# EasyEDA Pro project ProPrj_火车手动控制开关_2025-05-28.epro, schematic Schematic1

## Sheets
1 P1: Board Name: Board1; Create Date: 2025-05-04; Page Name: P1; Project Name: 火车手动控制开关_v100; Schematic Name: Schematic1; Update Date: 2025-05-04; Company: 嘉立创EDA; Page Size: A4; Version: V1.0
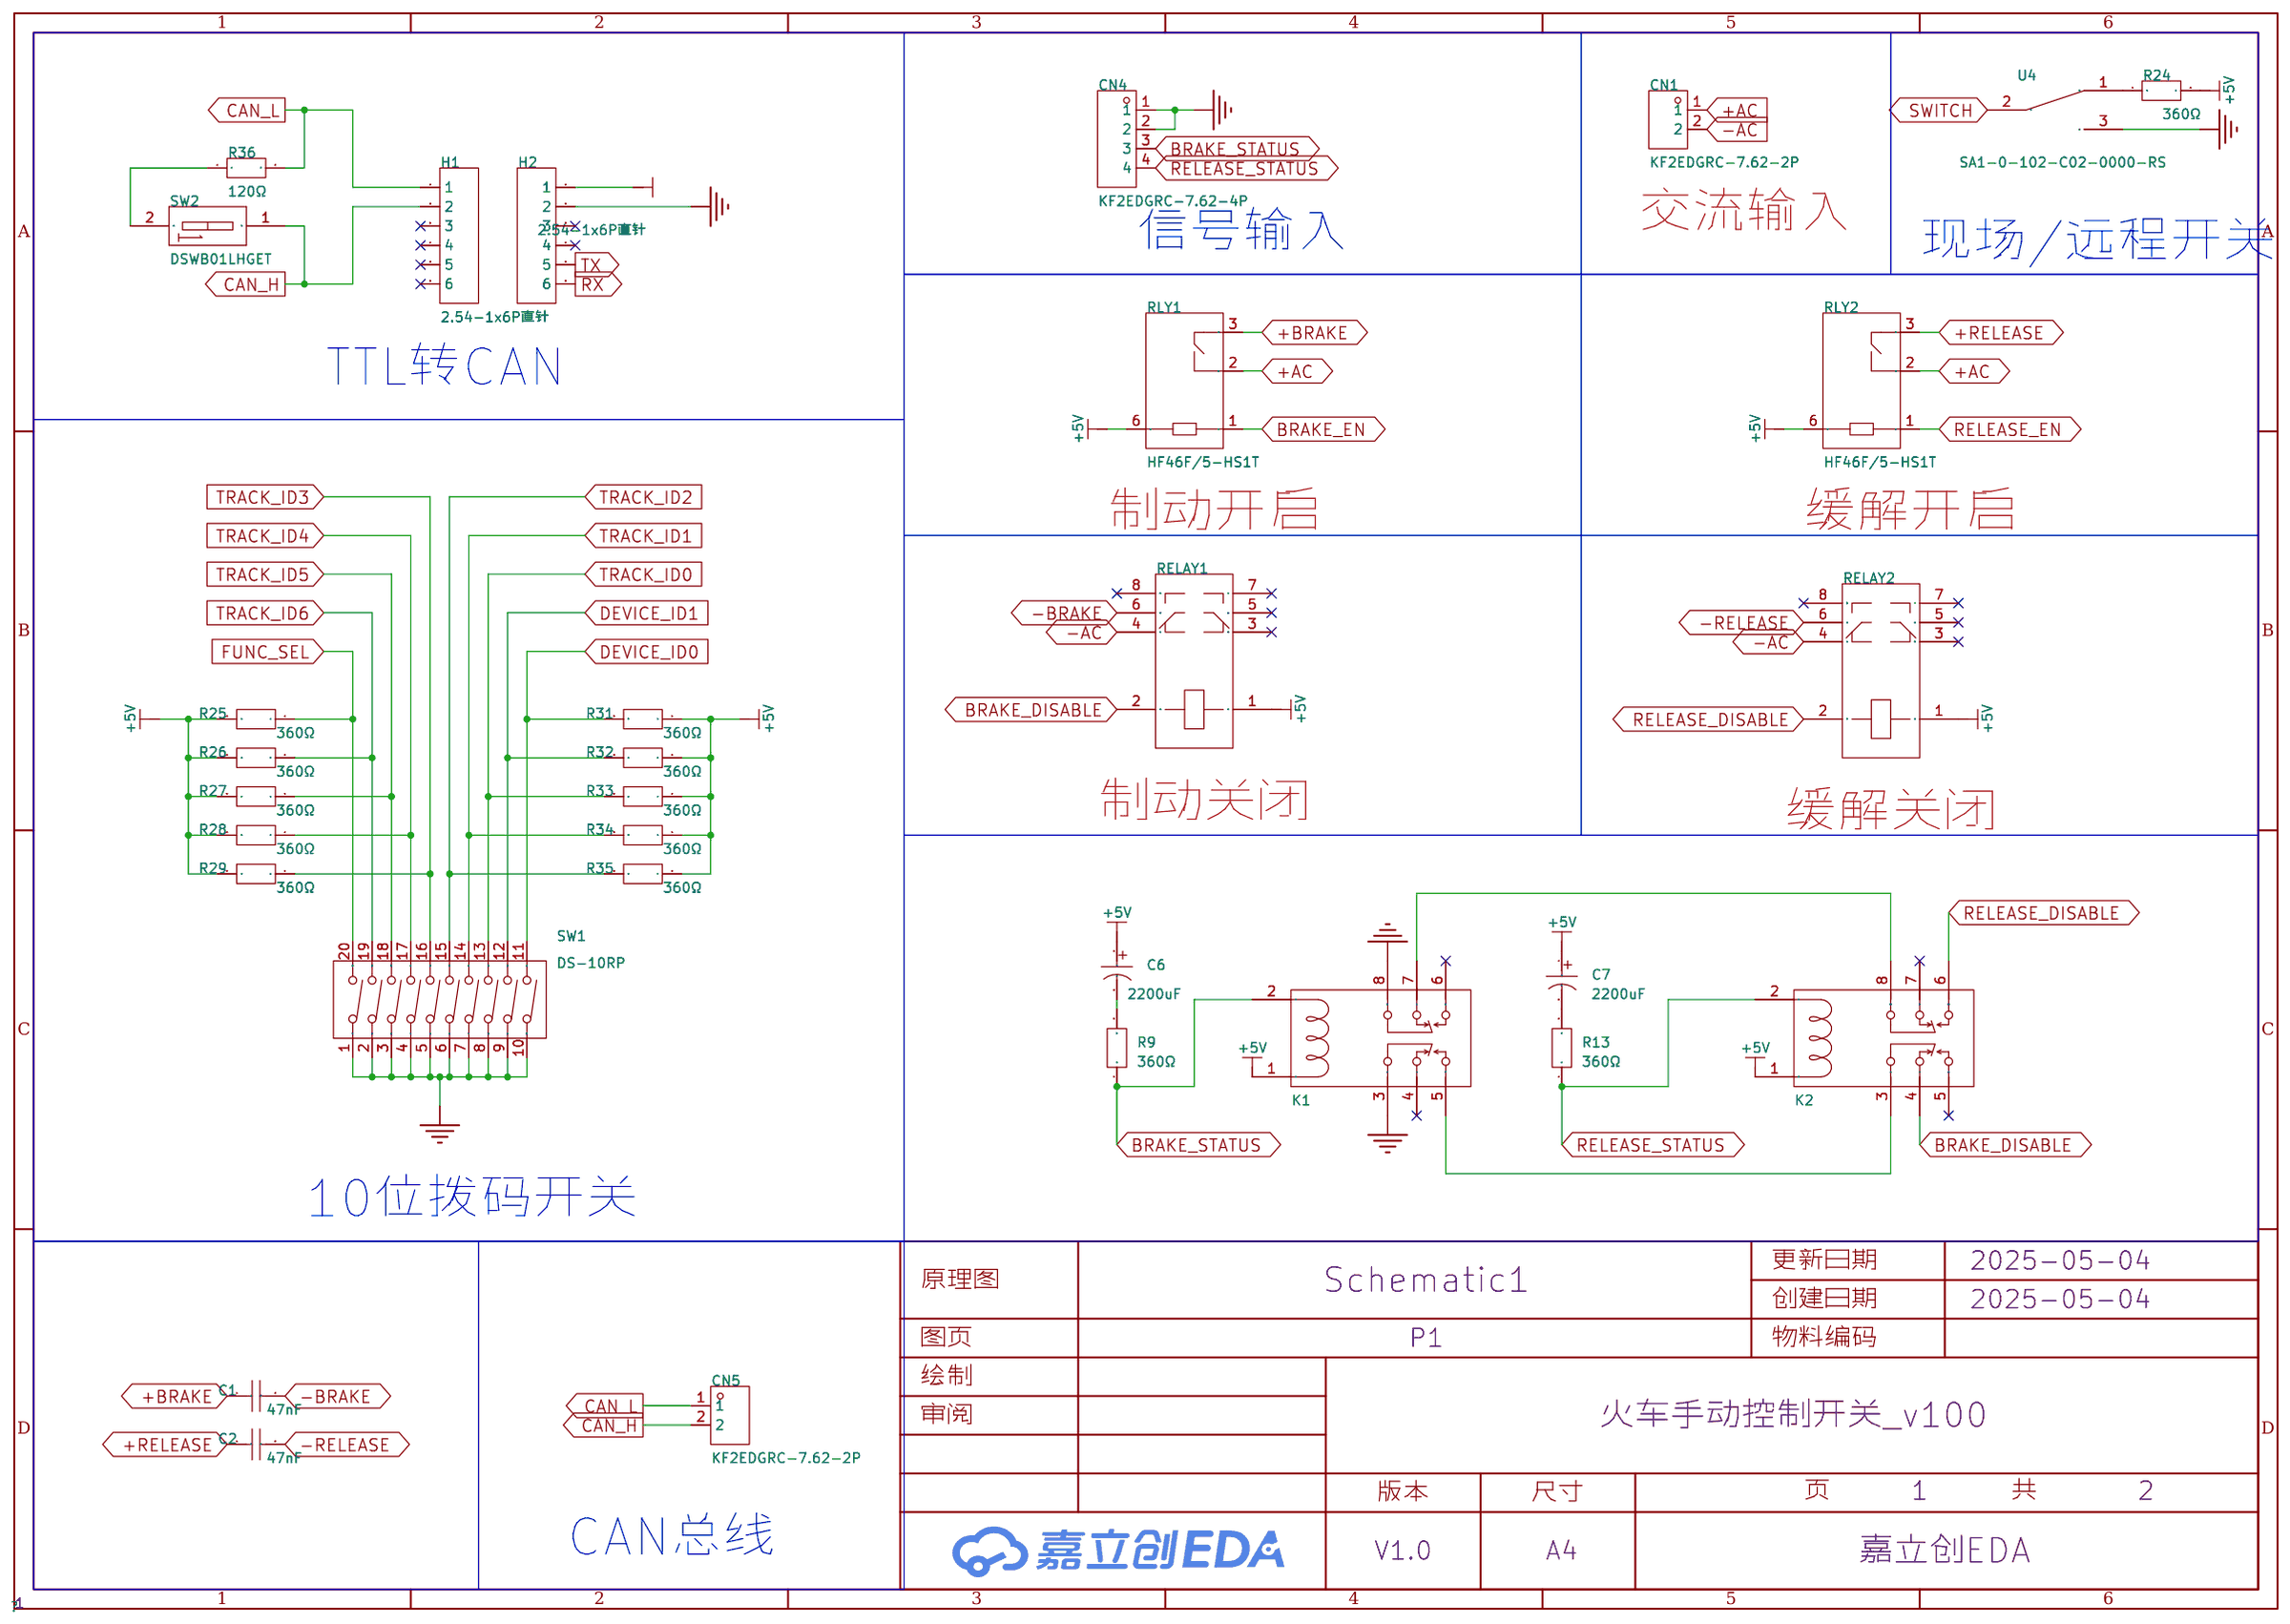
[diagram p0: P1]
2 P2: Create Date: 2025-04-07; Page Name: P2; Project Name: 火车制动系统; Update Date: 2025-04-19
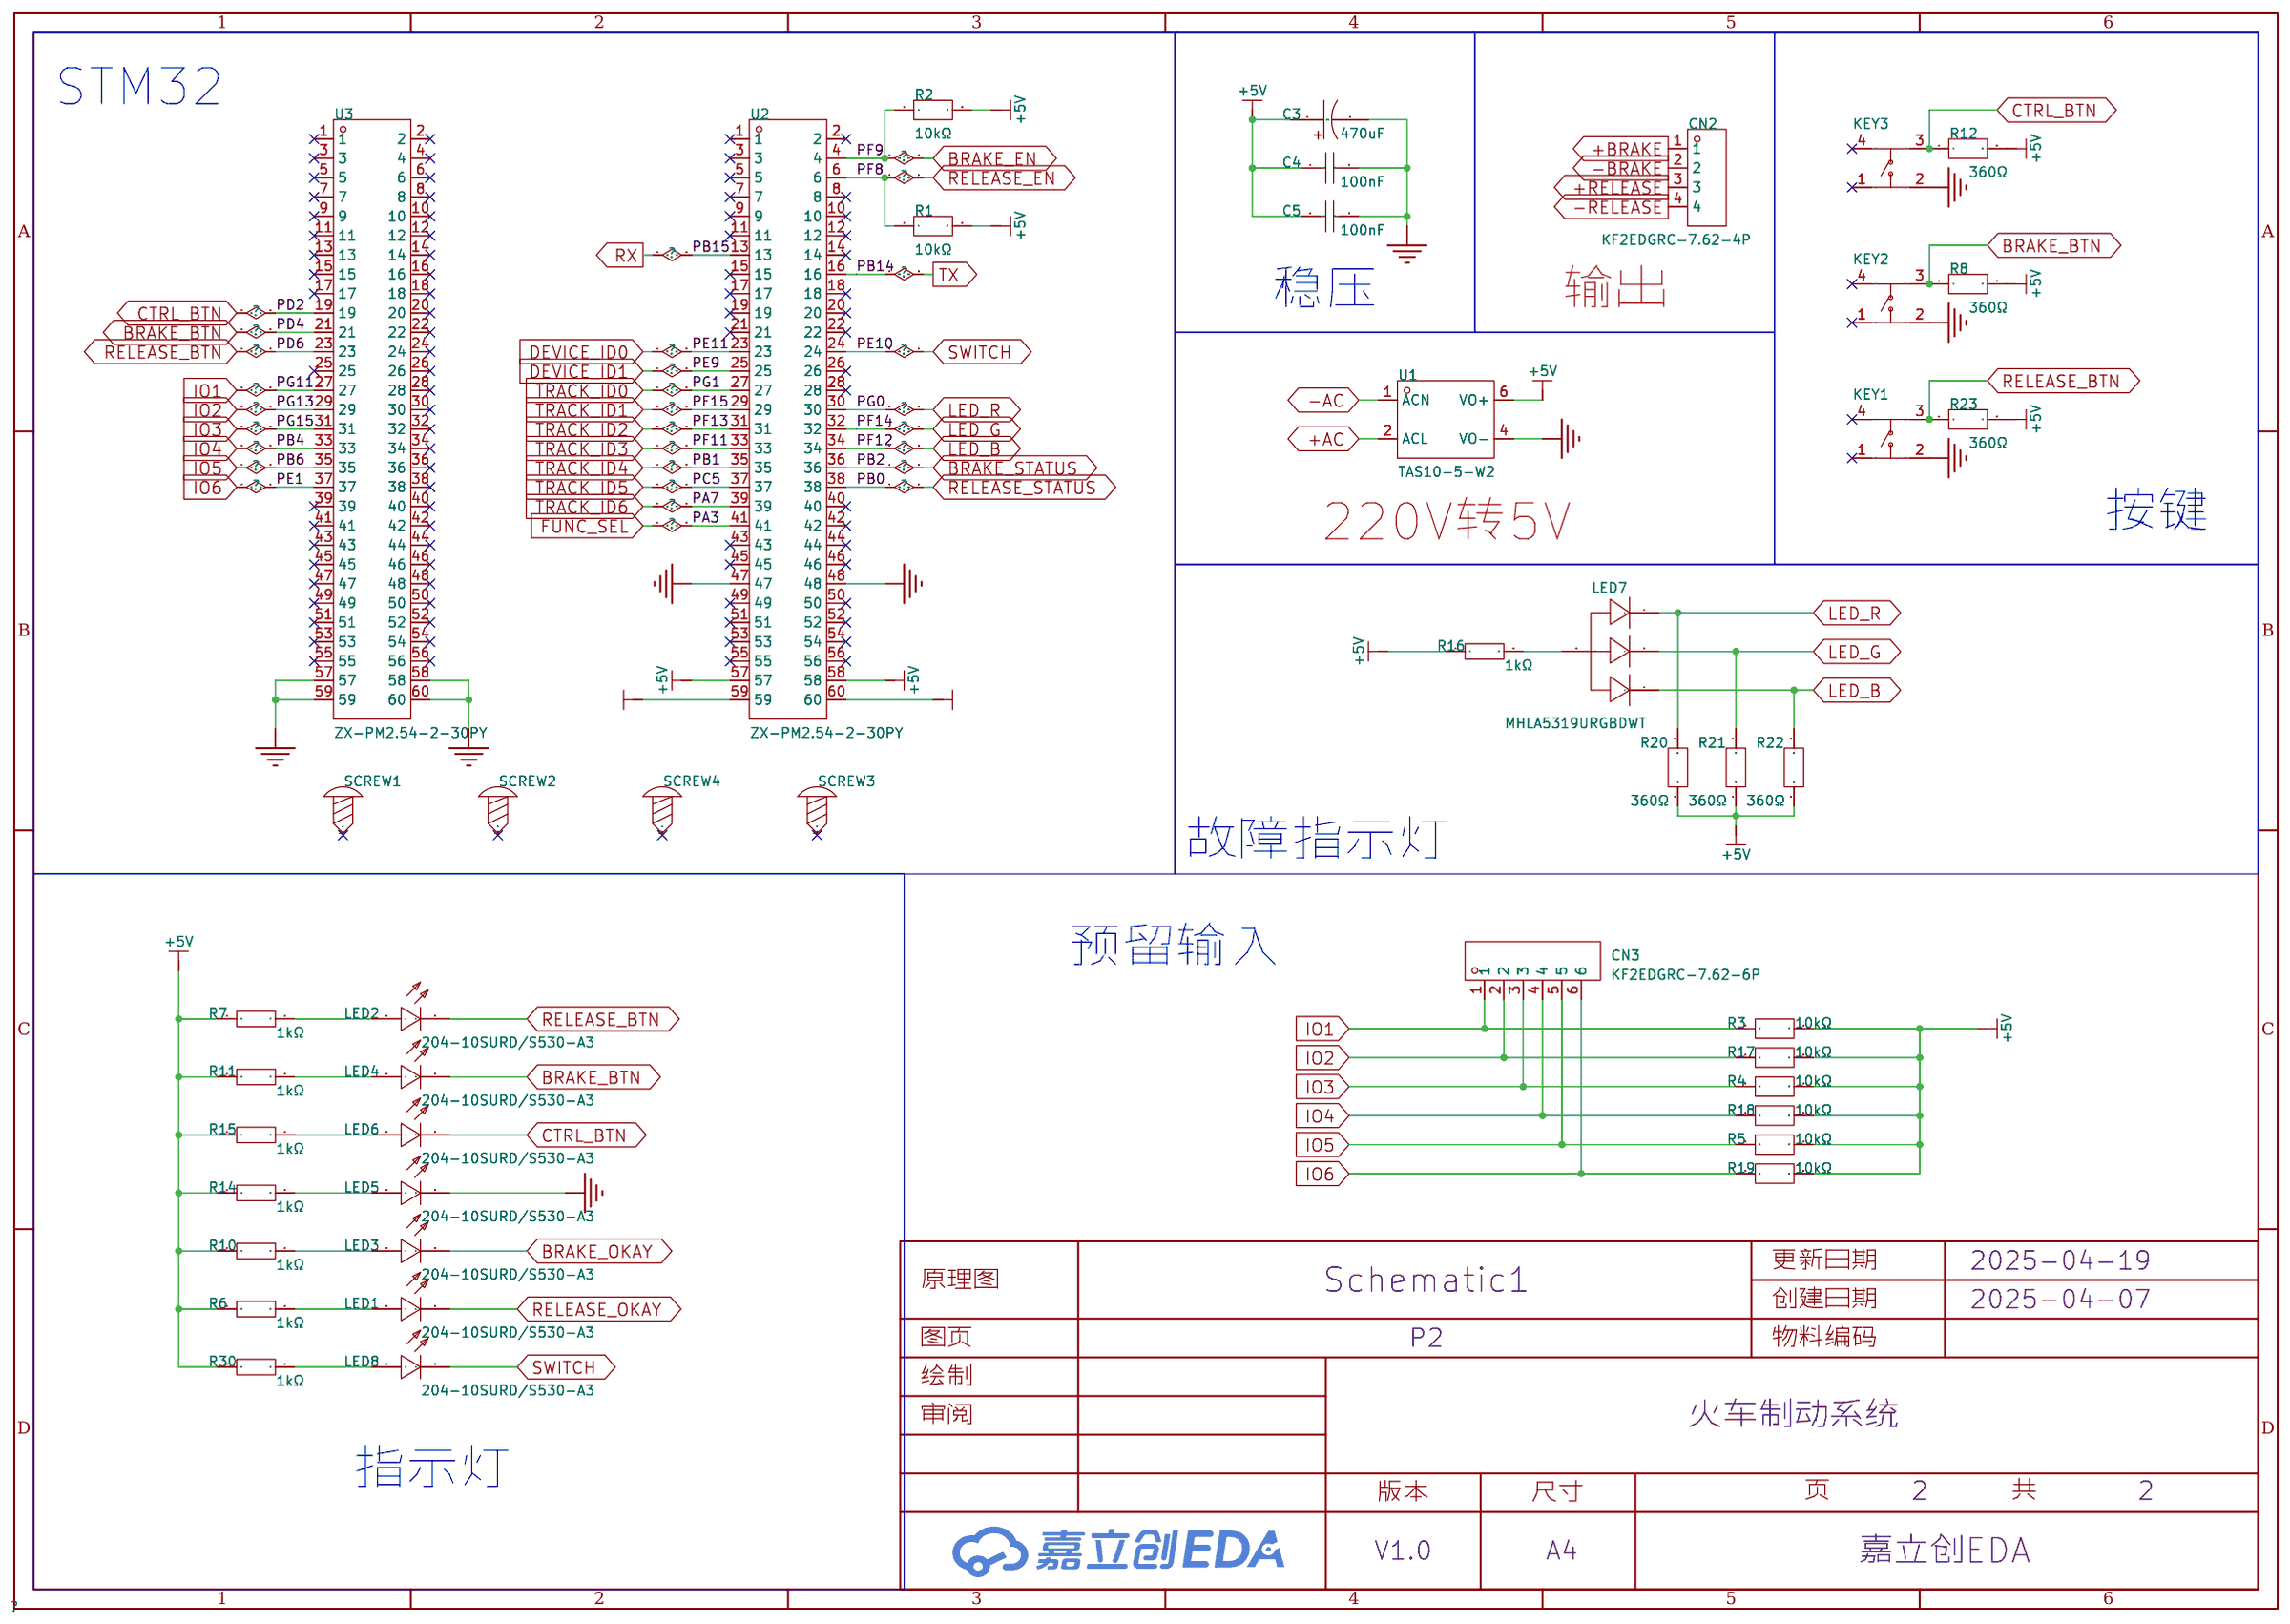
[diagram p1: P2]

## Parts
sheet P1
C1  47nF  [CAP-TH_L18.0-W5.0-P15.00-D0.8]
C2  47nF  [CAP-TH_L18.0-W5.0-P15.00-D0.8]
C6  2200uF  [CAP-TH_BD10.0-P5.00-D1.0-FD]
C7  2200uF  [CAP-TH_BD10.0-P5.00-D1.0-FD]
CN1  KF2EDGRC-7.62-2P  [CONN-TH_P7.62_KF2EDGRC-7.62-2P]
CN4  KF2EDGRC-7.62-4P  [CONN-TH_4P-P7.62_KF2EDGRC-7.62-4P]
CN5  KF2EDGRC-7.62-2P  [CONN-TH_P7.62_KF2EDGRC-7.62-2P]
H1  2.54-1x6P直针  [HDR-TH_6P-P2.54-V-M-1]
H2  2.54-1x6P直针  [HDR-TH_6P-P2.54-V-M-1]
K1  HRS2H-S-DC5V-N  [RELAY-TH_HRS2H-S-XX]
K2  HRS2H-S-DC5V-N  [RELAY-TH_HRS2H-S-XX]
R9  360Ω  [R1210]
R13  360Ω  [R1210]
R24  360Ω  [R1210]
R25  360Ω  [R1210]
R26  360Ω  [R1210]
R27  360Ω  [R1210]
R28  360Ω  [R1210]
R29  360Ω  [R1210]
R31  360Ω  [R1210]
R32  360Ω  [R1210]
R33  360Ω  [R1210]
R34  360Ω  [R1210]
R35  360Ω  [R1210]
R36  120Ω  [R1210]
RELAY1  HF115F/005-2ZS4  [RELAY-TH_HF115F-024-2ZS4]
RELAY2  HF115F/005-2ZS4  [RELAY-TH_HF115F-024-2ZS4]
RLY1  HF46F/5-HS1T  [RELAYS-TH_HF46F-XX-HS1-XXX]
RLY2  HF46F/5-HS1T  [RELAYS-TH_HF46F-XX-HS1-XXX]
SW1  DS-10RP  [SW-TH_DS-10RP]
SW2  DSWB01LHGET  [SW-TH_DSWB01LHGET]
U4  SA1-0-102-C02-0000-RS  [SW-TH_SA1-0-102-C02-0000-RS]
sheet P2
C3  470uF  [CAP-TH_BD8.0-P3.50-D0.6-FD]
C4  100nF  [C1210]
C5  100nF  [C1210]
CN2  KF2EDGRC-7.62-4P  [CONN-TH_4P-P7.62_KF2EDGRC-7.62-4P]
CN3  KF2EDGRC-7.62-6P  [CONN-TH_6P-P7.62_KF2EDGRC-7.62-6P]
KEY1  B3F-4055  [KEY-TH_4P-L12.0-W12.0-P5.00-LS13.4-EH]
KEY2  B3F-4055  [KEY-TH_4P-L12.0-W12.0-P5.00-LS13.4-EH]
KEY3  B3F-4055  [KEY-TH_4P-L12.0-W12.0-P5.00-LS13.4-EH]
LED1  204-10SURD/S530-A3  [LED-TH_BD3.0-P2.54-FD]
LED2  204-10SURD/S530-A3  [LED-TH_BD3.0-P2.54-FD]
LED3  204-10SURD/S530-A3  [LED-TH_BD3.0-P2.54-FD]
LED4  204-10SURD/S530-A3  [LED-TH_BD3.0-P2.54-FD]
LED5  204-10SURD/S530-A3  [LED-TH_BD3.0-P2.54-FD]
LED6  204-10SURD/S530-A3  [LED-TH_BD3.0-P2.54-FD]
LED7  MHLA5319URGBDWT  [LED-TH_4P-BD6.9-P1.27-R]
LED8  204-10SURD/S530-A3  [LED-TH_BD3.0-P2.54-FD]
R1  10kΩ  [R1210]
R2  10kΩ  [R1210]
R3  10kΩ  [R1210]
R4  10kΩ  [R1210]
R5  10kΩ  [R1210]
R6  1kΩ  [R1210]
R7  1kΩ  [R1210]
R8  360Ω  [R1210]
R10  1kΩ  [R1210]
R11  1kΩ  [R1210]
R12  360Ω  [R1210]
R14  1kΩ  [R1210]
R15  1kΩ  [R1210]
R16  1kΩ  [R1210]
R17  10kΩ  [R1210]
R18  10kΩ  [R1210]
R19  10kΩ  [R1210]
R20  360Ω  [R1210]
R21  360Ω  [R1210]
R22  360Ω  [R1210]
R23  360Ω  [R1210]
R30  1kΩ  [R1210]
SCREW1  -  [M4螺丝]
SCREW2  -  [M4螺丝]
SCREW3  -  [M4螺丝]
SCREW4  -  [M4螺丝]
U1  TAS10-5-W2  [PWRM-TH_TAS10-XX-W2]
U2  ZX-PM2.54-2-30PY  [HDR-TH_60P-P2.54-V-F-R2-C30-S2.54]
U3  ZX-PM2.54-2-30PY  [HDR-TH_60P-P2.54-V-F-R2-C30-S2.54]

## Library data of the parts
C1 C2 = MEX473K275A01: 容值:47nF;精度:±10%;电压(AC):275V;等级:X2;; LCSC Part Name: 等级:X2 47nF ±10% 275V; Supplier Part: C8970; Manufacturer: TENTA(天泰); Supplier Footprint: 插件,P=15mm; JLCPCB Part Class: 扩展库; Datasheet: https://atta.szlcsc.com/upload/public/pdf/source/20180207/C180193_15179897177401356415.pdf; Supplier: LCSC; Tolerance: ±10%; Voltage(AC): 275V; Subclass: X2
C6 C7 = KF222M016G200A: 容值:2200uF;精度:±20%;额定电压:16V;; LCSC Part Name: 2200uF ±20% 16V; Supplier Part: C77730; Manufacturer: CapXon(丰宾); Supplier Footprint: 插件,D10xL20mm; JLCPCB Part Class: 扩展库; Datasheet: https://atta.szlcsc.com/upload/public/pdf/source/20190311/C77730_4071F7D6331134CE149FE96A0814C9E0.pdf; Supplier: LCSC; Tolerance: ±20%; Rated Voltage: 16V; Lead Spacing: 5mm; φD: 10mm; L: 20mm; Lifetime @ Temp: 5000hrs@105℃
CN1 CN5 = KF2EDGRC-7.62-2P: 连接器类型:板端/插座-闭口;结构:1x2P;间距:7.62mm;颜色:绿色;安装方式:弯针;排数:1;每排PIN数:2;额定电流:15A;额定电压:400V;工作温度范围:-40℃~+105℃;; LCSC Part Name: 7.62mm 1x2P 排数:1 每排P数:2; Supplier Part: C441246; Manufacturer: KEFA(科发); Supplier Footprint: 弯插,P=7.62mm; JLCPCB Part Class: 扩展库; Datasheet: https://atta.szlcsc.com/upload/public/pdf/source/20230331/98017C42E55659E793A45F1EF0D85FE6.pdf; Supplier: LCSC; Connector Type: 板端/插座-闭口; Structure: 1x2P; Pitch: 7.62mm; Color: 绿色; Mounting Style: 弯针; Number of Rows: 1; Number of PINs Per Row: 2; Current Rating (Max): 15A; Voltage Rating (Max): 400V; Operating Temperature Range: -40℃~+105℃
CN2 CN4 = KF2EDGRC-7.62-4P: 连接器类型:板端/插座-闭口;结构:1x4P;间距:7.62mm;颜色:绿色;安装方式:弯针;排数:1;每排PIN数:4;额定电流:15A;额定电压:400V;工作温度范围:-40℃~+105℃;; LCSC Part Name: 7.62mm 1x4P 排数:1 每排P数:4; Supplier Part: C441248; Manufacturer: KEFA(科发); Supplier Footprint: 弯插,P=7.62mm; JLCPCB Part Class: 扩展库; Datasheet: https://atta.szlcsc.com/upload/public/pdf/source/20230331/98017C42E55659E793A45F1EF0D85FE6.pdf; Supplier: LCSC; Connector Type: 板端/插座-闭口; Structure: 1x4P; Pitch: 7.62mm; Color: 绿色; Mounting Style: 弯针; Number of Pins: 4P; Number of Rows: 1; Number of PINs Per Row: 4; Current Rating (Max): 15A; Voltage Rating (Max): 400V; Operating Temperature Range: -40℃~+105℃
H1 H2 = 2.54-1x6P直针: 插针结构:1x6P;间距:2.54mm;行距:-;圆针/方针:方针;安装方式:直插;排数:单排;总PIN位数:6P;额定电流:3A;额定电压:-;配合针长度:-;塑高:-;触头材质:黄铜;触头镀层:-;工作温度:-40℃~+105℃;颜色:黑色;; LCSC Part Name: 1x6P 间距:2.54mm 方针 直插; Supplier Part: C37208; Manufacturer: BOOMELE(博穆精密); Supplier Footprint: 插件,P=2.54mm; JLCPCB Part Class: Extended Part; Datasheet: https://atta.szlcsc.com/upload/public/pdf/source/20250115/42A019761A40C8B839643401D8CA5A96.pdf; Supplier: LCSC; Pin Structure: 1x6P; Pitch: 2.54mm; Circluar Pins/Square Pins: 方针; Mounting Type: 直插; Number of Rows: 单排; Number of Pins: 6P; Current Rating: 3A; Contact Material: 黄铜; Operating Temperature: -40℃~+105℃; Color: 黑色
K1 K2 = HRS2H-S-DC5V-N: 线圈电压:-;触点形式:-;触点容量(电阻负载):-;最大切换电压:-;最大切换电流:-;; Supplier Part: C13497; Manufacturer: HKE(汇港); Supplier Footprint: DIP,9.9x21mm; JLCPCB Part Class: Extended Part; Datasheet: https://atta.szlcsc.com/upload/public/pdf/source/20161108/1478586357401.pdf; Supplier: LCSC
R8 R9 R12 R13 R20-R29 R31-R35 = AC1210JR-07360RL: 电阻类型:厚膜电阻;阻值:360Ω;精度:±5%;功率:500mW;最大工作电压:200V;温度系数:±100ppm/℃;; LCSC Part Name: 厚膜电阻 360Ω ±5% 500mW; Supplier Part: C230448; Manufacturer: YAGEO(国巨); Supplier Footprint: 1210; JLCPCB Part Class: 扩展库; Datasheet: https://atta.szlcsc.com/upload/public/pdf/source/20191108/C230504_7FB43CAE7E86B3B2980C2491161B254C.pdf; Supplier: LCSC; Type: 厚膜电阻; Tolerance: ±5%; Power(Watts): 500mW; Overload Voltage (Max): 200V; Temperature Coefficient: ±100ppm/℃; Operating Temperature Range: -55℃~+155℃
R36 = FRC1210J121 TS: 电阻类型:厚膜电阻;阻值:120Ω;精度:±5%;功率:500mW;最大工作电压:200V;温度系数:±100ppm/℃;; LCSC Part Name: 厚膜电阻 120Ω ±5% 500mW; Supplier Part: C2933833; Manufacturer: FOJAN(富捷); Supplier Footprint: 1210; JLCPCB Part Class: 扩展库; Datasheet: https://atta.szlcsc.com/upload/public/pdf/source/20211221/925EC7D7225764EE0046F22065062C87.pdf; Supplier: LCSC; Type: 厚膜电阻; Tolerance: ±5%; Power(Watts): 500mW; Overload Voltage (Max): 200V; Temperature Coefficient: ±100ppm/℃; Operating Temperature Range: -55℃~+155℃
RELAY1 RELAY2 = HF115F/005-2ZS4: 线圈电压:5V;触点形式:两组转换:2C(双刀双掷-转换);触点容量(电阻负载):8A@250VAC;最大切换电压:440V@AC；300V@DC;最大切换电流:8A;; Supplier Part: C9226; Manufacturer: HF(宏发); Supplier Footprint: DIP,12.7x29mm; JLCPCB Part Class: 扩展库; Datasheet: https://atta.szlcsc.com/upload/public/pdf/source/20180326/C9226_00E5F9D0110139C053E72FC6A3214472.pdf; Supplier: LCSC; Coil Voltage: 5V; Contact Form: 两组转换:2C(双刀双掷-转换); Pin Number: 8; Contact Rating: 8A@250VAC; Maximum Switching Voltage: 440V@AC；300V@DC; Coil Rated Power: 400mW; Contact Material: AgCdO; Maximum Switching Current: 8A; Coil Type: 无极性-单线圈; Coil Resistance: 62Ω; Contact Resistance: 100mΩ; Operate Time: 15ms; Release Time: 8ms; Operating Temperature: -40℃~+85℃
RLY1 RLY2 = HF46F/5-HS1T_C3036134: 线圈电压:5V;触点形式:一组常开:1A(单刀单掷-常开);触点容量(电阻负载):5A@30VDC；5A@250VAC;最大切换电压:277V@AC；30V@DC;最大切换电流:5A;; LCSC Part Name: 超小型中功率5V继电器 单刀单掷-常开; Supplier Part: C3036134; Manufacturer: HF(宏发); Supplier Footprint: 插件,7x20.5mm; JLCPCB Part Class: Extended Part; Datasheet: https://atta.szlcsc.com/upload/public/pdf/source/20180301/C182930_15198945723621384141.pdf; Supplier: LCSC; Coil Voltage: 5V; Contact Form: 一组常开:1A(单刀单掷-常开); Pin Number: 4; Contact Rating: 5A@30VDC；5A@250VAC; Maximum Switching Voltage: 277V@AC；30V@DC; Coil Rated Power: 200mW; Contact Material: AgSnO2; Maximum Switching Current: 5A; Coil Type: 无极性-单线圈; Coil Resistance: 125Ω; Contact Resistance: 100mΩ; Operate Time: 10ms; Release Time: 10ms; Operating Temperature: -40℃~+85℃
SW1 = DS-10RP: 类型:平拨,凸起式;电路结构:单刀单掷;开关位数:10位;额定电流:25mA;额定电压:24V;使用寿命:3千次;颜色:红色;; LCSC Part Name: 间距2.54mm 平拨,凸起式 10位拨码开关; Supplier Part: C458082; Manufacturer: 韩国韩荣; Supplier Footprint: 插件; JLCPCB Part Class: 扩展库; Datasheet: https://atta.szlcsc.com/upload/public/pdf/source/20210810/ECF2F28B1CE673E7F9581E27682BDB10.pdf; Supplier: LCSC; Type: 平拨,凸起式; Circuit: 单刀单掷; Number of Positions: 10位; Lead Pitch: 2.54mm; Current Rating: 25mA; Voltage Rating: 24V; Operating Temperature: -20℃~+70℃; Operating Life: 3千次; Color: 红色
SW2 = DSWB01LHGET: 类型:平拨,凸起式;电路结构:单刀单掷;开关位数:1位;使用寿命:-;颜色:红色;; LCSC Part Name: 红色宽体1位顶拨插件; Supplier Part: C126888; Manufacturer: YE; Supplier Footprint: 插件,9.9x4mm; JLCPCB Part Class: 扩展库; Datasheet: https://atta.szlcsc.com/upload/public/pdf/source/20240423/2AB41BE17D24959C6789B2A71E54D492.pdf; Supplier: LCSC; Type: 平拨,凸起式; Circuit: 单刀单掷; Number of Positions: 1位; Color: 红色
U4 = SA1-0-102-C02-0000-RS: LCSC Part Name: 超小型钮子开关 3脚2档 防水全塑胶; Supplier Part: C22449121; Manufacturer: YUEN FUNG(源丰); Supplier Footprint: 插件-3P,8.1x5.9mm; JLCPCB Part Class: 扩展库; Datasheet: https://atta.szlcsc.com/upload/public/pdf/source/20240530/DFC727F3C9E3BD30CF712B124CBCA431.pdf; Supplier: LCSC
C3 = ERS1CM471F12OT: 容值:470uF;精度:±20%;额定电压:16V;; LCSC Part Name: 470uF ±20% 16V; Supplier Part: C160146; Manufacturer: AISHI(艾华集团); Supplier Footprint: 插件,D8xL12mm; JLCPCB Part Class: 扩展库; Datasheet: https://atta.szlcsc.com/upload/public/pdf/source/20191015/C438940_4B8E60A742BB0AE40DDEF87A5C89089D.pdf; Supplier: LCSC; Tolerance: ±20%; Rated Voltage: 16V; Lead Spacing: 3.5mm; φD: 8mm; L: 12mm; Lifetime @ Temp: 7000hrs@105℃
C4 C5 = 1210B104K500NT: 容值:100nF;精度:±10%;额定电压:50V;材质(温度系数):X7R;; LCSC Part Name: 100nF ±10% 50V; Supplier Part: C76567; Manufacturer: FH(风华); Supplier Footprint: 1210; JLCPCB Part Class: 扩展库; Datasheet: https://atta.szlcsc.com/upload/public/pdf/source/20200305/C486355_26A10D38EF8C2A5C37091D0039909270.pdf; Supplier: LCSC; Tolerance: ±10%; Voltage Rated: 50V; Temperature Coefficient: X7R
CN3 = KF2EDGRC-7.62-6P: 连接器类型:板端/插座-闭口;结构:1x6P;间距:7.62mm;颜色:绿色;安装方式:弯针;排数:1;每排PIN数:6;额定电流:15A;额定电压:400V;工作温度范围:-40℃~+105℃;; LCSC Part Name: 7.62mm 1x6P 排数:1 每排P数:6; Supplier Part: C441250; Manufacturer: KEFA(科发); Supplier Footprint: 弯插,P=7.62mm; JLCPCB Part Class: 扩展库; Datasheet: https://atta.szlcsc.com/upload/public/pdf/source/20230331/98017C42E55659E793A45F1EF0D85FE6.pdf; Supplier: LCSC; Connector Type: 板端/插座-闭口; Structure: 1x6P; Pitch: 7.62mm; Color: 绿色; Mounting Style: 弯针; Number of Pins: 6P; Number of Rows: 1; Number of PINs Per Row: 6; Current Rating (Max): 15A; Voltage Rating (Max): 400V; Operating Temperature Range: -40℃~+105℃
KEY1-KEY3 = B3F-4055_C84931: 电路结构:单刀单掷;按钮形状:矩形按钮;安装方式:直插;开关长度:12mm;开关宽度:12mm;开关高度:7.3mm;触点电流:50mA;额定电压(DC):24V;带灯:-;机械寿命:-;; LCSC Part Name: 12*12*7.3mm 直插 轻触开关; Supplier Part: C84931; Manufacturer: OMRON(欧姆龙); Supplier Footprint: 插件; JLCPCB Part Class: 扩展库; Datasheet: https://atta.szlcsc.com/upload/public/pdf/source/20170810/C93157_1502335414592880008.pdf; Supplier: LCSC; Circuit: 单刀单掷; Actuator Style: 矩形按钮; Mounting Style: 直插; Switch Length: 12mm; Switch Width: 12mm; Switch Height: 7.3mm; Contact Current: 50mA; Voltage Rating (DC): 24V
LED1-LED6 LED8 = 204-10SURD/S530-A3: 灯头类型:3mm圆形灯头;发光颜色:红色;正向电压(VF):2V;功率:60mW;正向电流:20mA;主波长:624nm;二极管配置:-;透镜颜色:雾状红透镜;色温:-;发光强度:80mcd;发光角度:45°;载带方式:-;工作温度:-40℃~+85℃;; Supplier Part: C99772; Manufacturer: EVERLIGHT(亿光); Supplier Footprint: 插件,D=3mm; JLCPCB Part Class: Extended Part; Datasheet: https://atta.szlcsc.com/upload/public/pdf/source/20170504/1493866937400.pdf; Supplier: LCSC; Lamp Holder Type: 3mm圆形灯头; Emitted Color: 红色; Forward Voltage (VF): 2V; Power Dissipation: 60mW; Forward Current: 20mA; Dominant Wavelength: 624nm; Peak Wavelength: 632nm; Lens Color: 雾状红透镜; Luminous Intensity: 80mcd; Viewing Angle: 45°; Operating Temperature: -40℃~+85℃
LED7 = MHLA5319URGBDWT: LCSC Part Name: RGB三色; Supplier Part: C417349; Manufacturer: MEIHUA(美华); Supplier Footprint: 插件,D=5mm; JLCPCB Part Class: 扩展库; Datasheet: https://atta.szlcsc.com/upload/public/pdf/source/20190909/C417349_5EE64C2B845439F4B2C4E6D0A2E388FC.pdf; Supplier: LCSC
R1-R5 R17-R19 = 1210W2J0103T5E: 电阻类型:厚膜电阻;阻值:10kΩ;精度:±5%;功率:500mW;最大工作电压:200V;温度系数:±100ppm/℃;; LCSC Part Name: 10kΩ ±5% 500mW 厚膜电阻; Supplier Part: C474295; Manufacturer: UNI-ROYAL(厚声); Supplier Footprint: 1210; JLCPCB Part Class: 扩展库; Datasheet: https://atta.szlcsc.com/upload/public/pdf/source/20200306/C422600_1E6D84923E4A46A82E41ADD87F860B5C.pdf; Supplier: LCSC; Type: 厚膜电阻; Tolerance: ±5%; Power(Watts): 500mW; Overload Voltage (Max): 200V; Temperature Coefficient: ±100ppm/℃; Operating Temperature Range: -55℃~+155℃
R6 R7 R10 R11 R14-R16 R30 = 1210W2J0102T5E: 电阻类型:厚膜电阻;阻值:1kΩ;精度:±5%;功率:500mW;最大工作电压:200V;温度系数:±100ppm/℃;; LCSC Part Name: 1kΩ ±5% 500mW 厚膜电阻; Supplier Part: C270888; Manufacturer: UNI-ROYAL(厚声); Supplier Footprint: 1210; JLCPCB Part Class: 扩展库; Datasheet: https://atta.szlcsc.com/upload/public/pdf/source/20200306/C422600_1E6D84923E4A46A82E41ADD87F860B5C.pdf; Supplier: LCSC; Type: 厚膜电阻; Tolerance: ±5%; Power(Watts): 500mW; Overload Voltage (Max): 200V; Temperature Coefficient: ±100ppm/℃; Operating Temperature Range: -55℃~+155℃
SCREW1-SCREW4 = M4螺丝: Supplier Footprint: 插件
U1 = TAS10-5-W2: 输出5V,峰值10W,精度1%,耐压大于2.5KVAC,工业级,该系列效率高达85%,待机功耗低至0.15W,输出纹波外加铝电容小于50mV，标准尺寸多厂家管脚兼容，DIP:38*19*18; Supplier Part: C2687655; Manufacturer: TDPOWER(腾达电源); Supplier Footprint: 插件,25x39mm; JLCPCB Part Class: Extended Part; Datasheet: https://atta.szlcsc.com/upload/public/pdf/source/20210914/95F169B7B21081D929A6CFE8A15609A6.pdf; Supplier: LCSC
U2 = ZX-PM2.54-2-30PY: 插孔结构:2x30P;间距:2.54mm;行距:2.54mm;圆孔/方孔:方孔;安装类型:直插;排数:双排;总孔位数:60P;额定电流:-;额定电压:1kV;插孔方向:顶部;塑高:8.5mm;触头材质:-;触头镀层:金;工作温度范围:-40℃~+105℃;焊接温度(最大值):260℃@5S;; LCSC Part Name: 2x30P 间距:2.54mm 直插; Supplier Part: C7499356; Manufacturer: Megastar(兆星); Supplier Footprint: 插件,P=2.54mm; JLCPCB Part Class: 扩展库; Datasheet: https://atta.szlcsc.com/upload/public/pdf/source/20231122/23E1107B34356833C267F6B6E856DE02.pdf; Supplier: LCSC; Holes Structure: 2x30P; Pitch: 2.54mm; Row Spacing: 2.54mm; Circular Hole / Square Hole: 方孔; Mounting Type: 直插; Number of Rows: 双排; Number of Holes: 60P; Voltage Rating (Max): 1kV; Holes Direction: 顶部; Insulation Height: 8.5mm; Contact Plating: 金; Operating Temperature Range: -40℃~+105℃; Soldering Temperature(Max): 260℃@5S
U3 = ZX-PM2.54-2-30PY: 插孔结构:2x30P;间距:2.54mm;行距:2.54mm;圆孔/方孔:方孔;安装类型:直插;排数:双排;总孔位数:60P;额定电流:-;额定电压:1kV;插孔方向:顶部;塑高:8.5mm;触头材质:-;触头镀层:金;工作温度范围:-40℃~+105℃;焊接温度(最大值):260℃@5S;; LCSC Part Name: 2x30P 间距:2.54mm 直插; Supplier Part: C7499356; Manufacturer: Megastar(兆星); Supplier Footprint: 插件,P=2.54mm; JLCPCB Part Class: Extended Part; Datasheet: https://atta.szlcsc.com/upload/public/pdf/source/20231122/23E1107B34356833C267F6B6E856DE02.pdf; Supplier: LCSC; Holes Structure: 2x30P; Pitch: 2.54mm; Row Spacing: 2.54mm; Circular Hole / Square Hole: 方孔; Mounting Type: 直插; Number of Rows: 双排; Number of Holes: 60P; Voltage Rating (Max): 1kV; Holes Direction: 顶部; Insulation Height: 8.5mm; Contact Plating: 金; Operating Temperature Range: -40℃~+105℃; Soldering Temperature(Max): 260℃@5S

## Nets
+3V3: H2.1 U2.59 U2.60
+5V: C3.1 C4.1 C5.1 C6.1 C7.1 K1.1 K2.1 R1.2 R2.2 R3.2 R4.2 R5.2 R6.1 R7.1 R8.2 R10.1 R11.1 R12.2 R14.1 R15.1 R16.1 R17.2 R18.2 R19.2 R20.1 R21.1 R22.1 R23.2 R24.2 R25.2 R26.2 R27.2 R28.2 R29.2 R30.1 R31.1 R32.1 R33.1 R34.1 R35.1 RELAY1.1 RELAY2.1 RLY1.6 RLY2.6 U1.6(VO+) U2.57 U2.58
GND: C3.2 C4.2 C5.2 CN4.1 CN4.2 H2.2 K1.3 K1.8 KEY1.2 KEY2.2 KEY3.2 LED5.2(K) SW1.1 SW1.2 SW1.3 SW1.4 SW1.5 SW1.6 SW1.7 SW1.8 SW1.9 SW1.10 U1.4(VO-) U2.47 U2.48 U3.57 U3.58 U3.59 U3.60 U4.3
+AC: CN1.1 RLY1.2 RLY2.2 U1.2(ACL)
+BRAKE: C1.1 CN2.1 RLY1.3
+RELEASE: C2.1 CN2.3 RLY2.3
-AC: CN1.2 RELAY1.4 RELAY2.4 U1.1(ACN)
-BRAKE: C1.2 CN2.2 RELAY1.6
-RELEASE: C2.2 CN2.4 RELAY2.6
BRAKE_BTN: KEY2.3 LED4.2(K) R8.1 U3.21
BRAKE_DISABLE: K2.4 RELAY1.2
BRAKE_EN: R2.1 RLY1.1 U2.4
BRAKE_OKAY: LED3.2(K)
BRAKE_STATUS: CN4.3 K1.2 R9.1 U2.36
CAN_H: CN5.2 H1.2 SW2.1(A1)
CAN_L: CN5.1 H1.1 R36.2
CTRL_BTN: KEY3.3 LED6.2(K) R12.1 U3.19
DEVICE_ID0: R31.2 SW1.11 U2.23
DEVICE_ID1: R32.2 SW1.12 U2.25
FUNC_SEL: R25.1 SW1.20 U2.41
IO1: CN3.1 R3.1 U3.27
IO2: CN3.2 R17.1 U3.29
IO3: CN3.3 R4.1 U3.31
IO4: CN3.4 R18.1 U3.33
IO5: CN3.5 R5.1 U3.35
IO6: CN3.6 R19.1 U3.37
LED_B: LED7.4(-) R22.2 U2.34
LED_G: LED7.3(-) R21.2 U2.32
LED_R: LED7.1(-) R20.2 U2.30
PA7: R26.1 SW1.19 U2.39
PB0: CN4.4 K2.2 R13.1 U2.38
PB1: R28.1 SW1.17 U2.35
PB14: H2.5 U2.16
PB15: H2.6 U2.13
PC5: R27.1 SW1.18 U2.37
PD6: KEY1.3 LED2.2(K) R23.1 U3.23
PE10: LED8.2(K) U2.24 U4.2
PF8: R1.1 RLY2.1 U2.6
PF11: R29.1 SW1.16 U2.33
PF13: R35.2 SW1.15 U2.31
PF15: R34.2 SW1.14 U2.29
PG1: R33.2 SW1.13 U2.27
RELEASE_DISABLE: K2.6 RELAY2.2
RELEASE_OKAY: LED1.2(K)
$1N6666: K1.5 K2.3
$1N6674: K1.7 K2.8
$1N37726: C6.2 R9.2
$1N37765: C7.2 R13.2
$1N43438: R36.1 SW2.2
$1N46433: R24.1 U4.1
$2N2785: LED2.1(A) R7.2
$2N2786: LED4.1(A) R11.2
$2N2787: LED6.1(A) R15.2
$2N2791: LED3.1(A) R10.2
$2N2794: LED1.1(A) R6.2
$2N2795: LED5.1(A) R14.2
$2N4277: LED8.1(A) R30.2
$2N10665: LED7.2(+) R16.2

Not connected (* = marked no-connect by the designer): H1 3* 4* 5* 6*; H2 3* 4*; K1 4* 6*; K2 5* 7*; KEY1 1* 4*; KEY2 1* 4*; KEY3 1* 4*; RELAY1 3* 5* 7* 8*; RELAY2 3* 5* 7* 8*; SCREW1 1*; SCREW2 1*; SCREW3 1*; SCREW4 1*; U2 1* 2* 3* 5* 7* 8* 9* 10* 11* 12* 14* 15* 17* 18* 19* 20* 21* 22* 26* 28* 40* 42* 43* 44* 45* 46* 49* 50* 51* 52* 53* 54* 55* 56*; U3 1* 2* 3* 4* 5* 6* 7* 8* 9* 10* 11* 12* 13* 14* 15* 16* 17* 18* 20* 22* 24* 25* 26* 28* 30* 32* 34* 36* 38* 39* 40* 41* 42* 43* 44* 45* 46* 47* 48* 49* 50* 51* 52* 53* 54* 55* 56*

## Notes on the sheets
sheet 1
- 交流输入
- 信号输入
- 现场/远程开关
- TTL转CAN
- 制动开启
- 缓解开启
- 制动关闭
- 缓解关闭
- 10位拨码开关
- CAN总线
sheet 2
- STM32
- 稳压
- 输出
- 220V转5V
- 按键
- 故障指示灯
- 预留输入
- 指示灯
